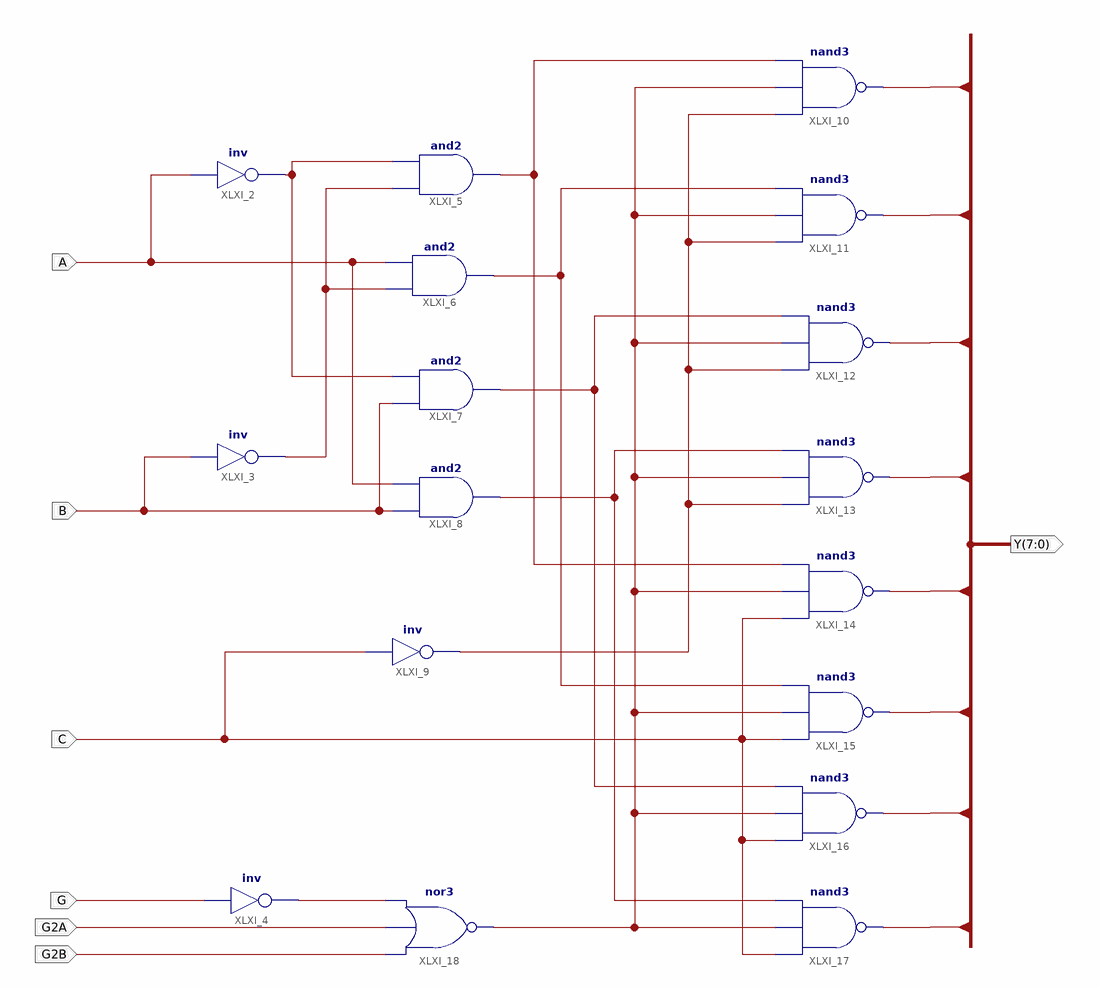
[diagram p0: schematic sheet 1]
// Xilinx ISE schematic D_74LS138.sch (kintex7) as structural Verilog: 17 symbols, 7 ports
module D_74LS138 (
  input  B,
  input  A,
  input  G,
  input  G2A,
  input  G2B,
  input  C,
  output [7:0] Y
);

  wire XLXN_13, XLXN_15, XLXN_19, XLXN_21, XLXN_23, XLXN_27, XLXN_33, XLXN_53, XLXN_83;

  not XLXI_3 (XLXN_15, B);
  and XLXI_5 (XLXN_33, XLXN_15, XLXN_13);
  and XLXI_6 (XLXN_19, XLXN_15, A);
  and XLXI_7 (XLXN_21, B, XLXN_13);
  and XLXI_8 (XLXN_23, B, A);
  not XLXI_2 (XLXN_13, A);
  nand XLXI_10 (Y[0], XLXN_83, XLXN_53, XLXN_33);
  nand XLXI_11 (Y[1], XLXN_83, XLXN_53, XLXN_19);
  nand XLXI_12 (Y[2], XLXN_83, XLXN_53, XLXN_21);
  nand XLXI_13 (Y[3], XLXN_83, XLXN_53, XLXN_23);
  nand XLXI_15 (Y[5], C, XLXN_53, XLXN_19);
  nand XLXI_16 (Y[6], C, XLXN_53, XLXN_21);
  nor XLXI_18 (XLXN_53, G2B, G2A, XLXN_27);
  not XLXI_4 (XLXN_27, G);
  nand XLXI_17 (Y[7], C, XLXN_53, XLXN_23);
  nand XLXI_14 (Y[4], C, XLXN_53, XLXN_33);
  not XLXI_9 (XLXN_83, C);
endmodule
